# EAGLE design BluePill (EAGLE 8.3.1)
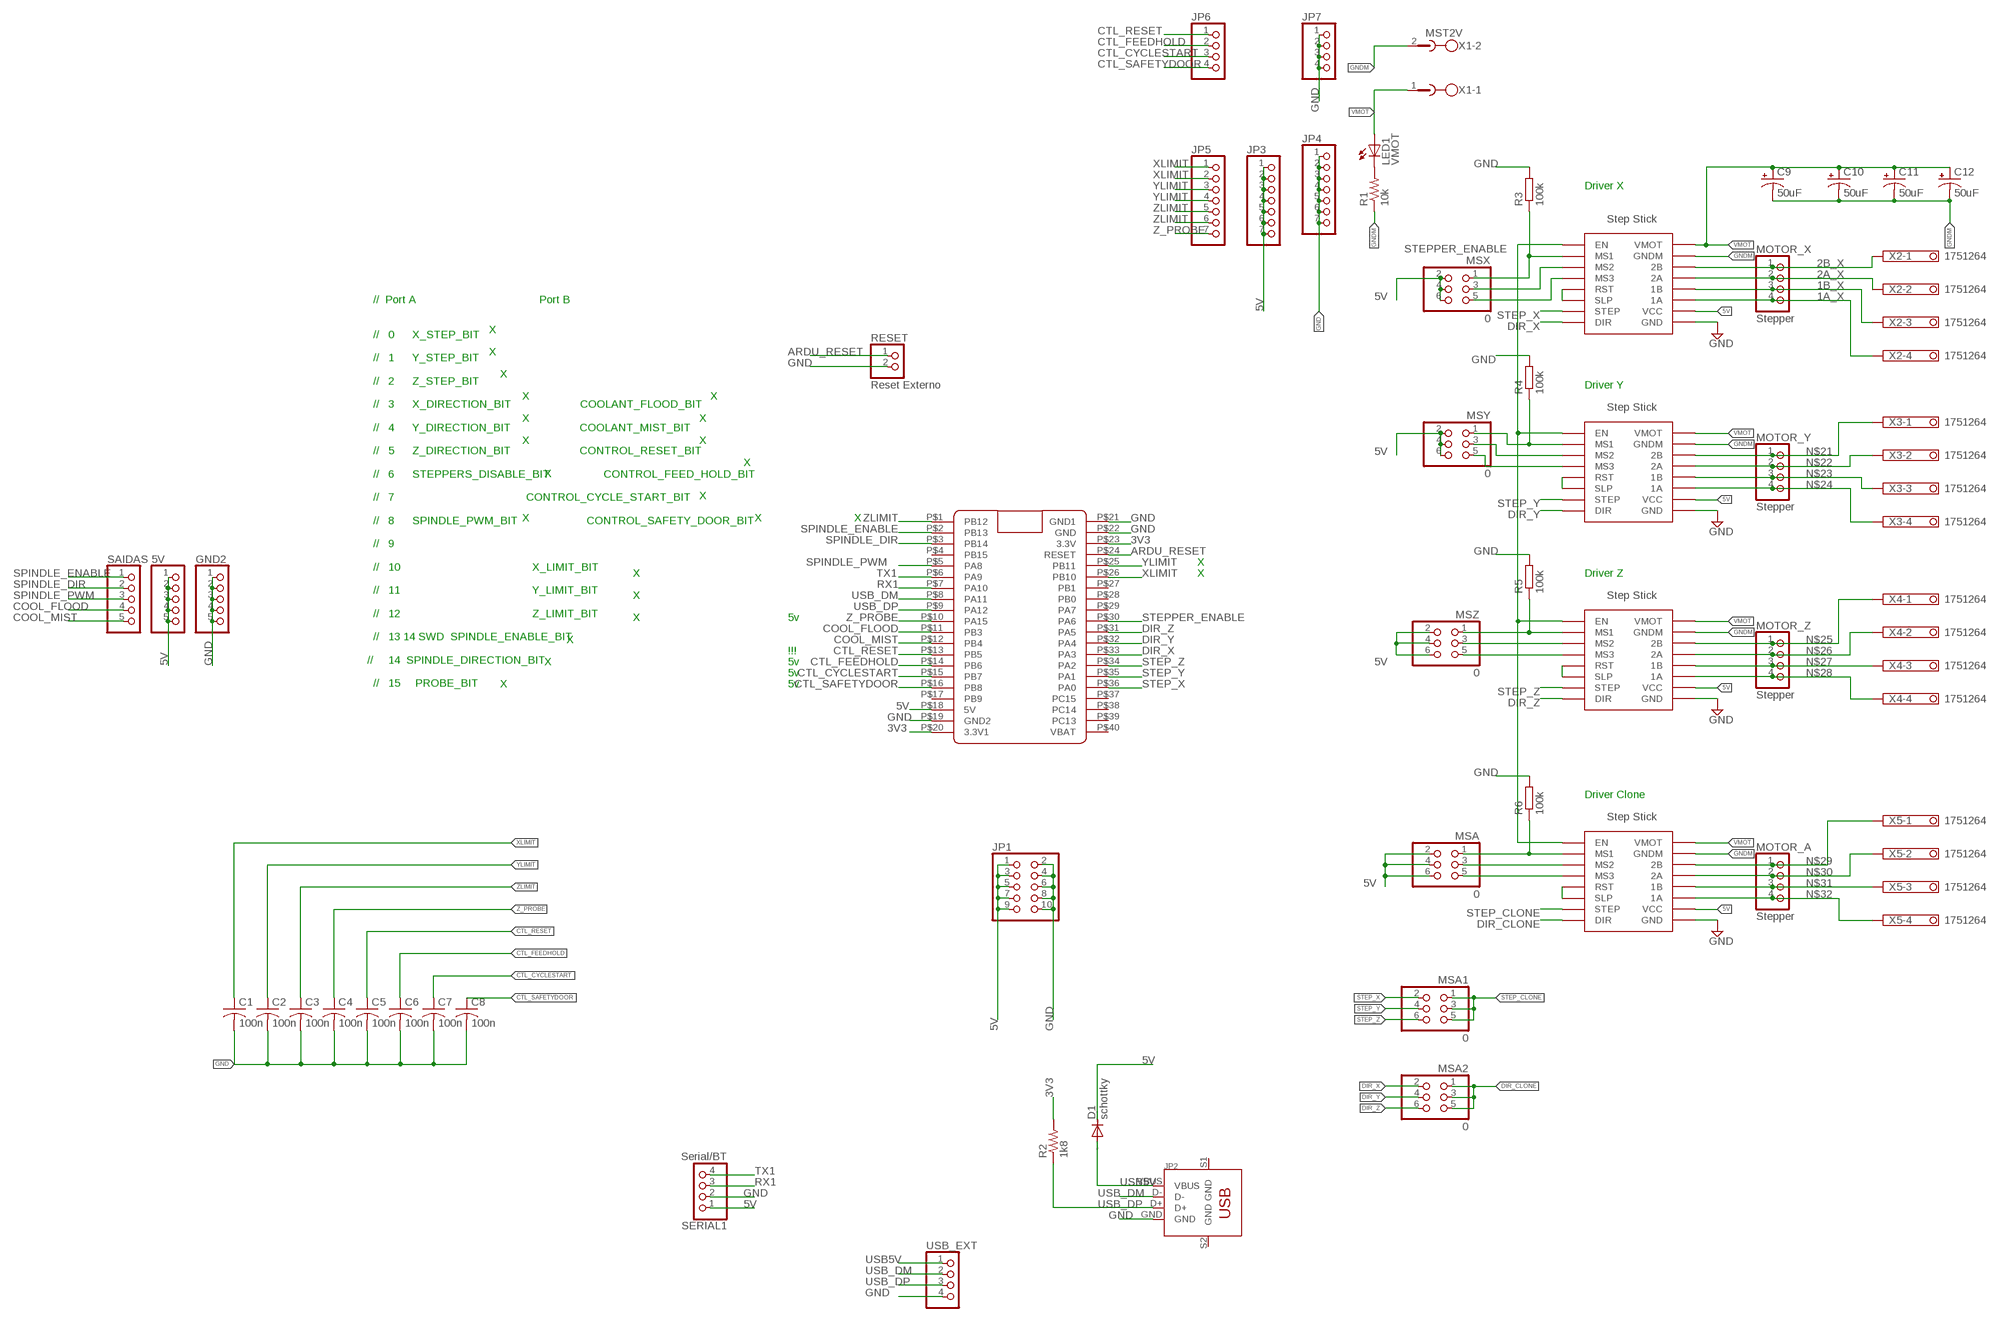
[diagram p0: schematic, sheet 1]

## Parts
5V  PINHD-1X5  [1X05]
C1  100n  C-USC0805K  [C0805K]
C2  100n  C-USC0805K  [C0805K]
C3  100n  C-USC0805K  [C0805K]
C4  100n  C-USC0805K  [C0805K]
C5  100n  C-USC0805K  [C0805K]
C6  100n  C-USC0805K  [C0805K]
C7  100n  C-USC0805K  [C0805K]
C8  100n  C-USC0805K  [C0805K]
C9  50uF  CPOL-USTT5D9L  [TT5D9L]
C10  50uF  CPOL-USTT5D9L  [TT5D9L]
C11  50uF  CPOL-USTT5D9L  [TT5D9L]
C12  50uF  CPOL-USTT5D9L  [TT5D9L]
D1  schottky  DIODE-DO-214AC  [DO-214AC]
DRIVER_CLONE  STEP-STICK  [STEP-STICK]
DRIVER_X  STEP-STICK  [STEP-STICK]
DRIVER_Y  STEP-STICK  [STEP-STICK]
DRIVER_Z  STEP-STICK  [STEP-STICK]
GND2  PINHD-1X5  [1X05]
JP1  PINHD-2X5  [2X05]
JP2  DIP-USB-B-TYPE-FMAL(4+2P-2.0-90D)  [USB4+2-2.5-90D-15.8X12MM]
JP3  PINHD-1X7  [1X07]
JP4  PINHD-1X7  [1X07]
JP5  PINHD-1X7  [1X07]
JP6  PINHD-1X4  [1X04]
JP7  PINHD-1X4  [1X04]
LED1  VMOT  LEDCHIP-LED0805  [CHIP-LED0805]
MOTOR_A  Stepper  PINHD-1X4  [1X04]
MOTOR_X  Stepper  PINHD-1X4  [1X04]
MOTOR_Y  Stepper  PINHD-1X4  [1X04]
MOTOR_Z  Stepper  PINHD-1X4  [1X04]
MSA  0  PINHD-2X3  [2X03]
MSA1  0  PINHD-2X3  [2X03]
MSA2  0  PINHD-2X3  [2X03]
MSX  0  PINHD-2X3  [2X03]
MSY  0  PINHD-2X3  [2X03]
MSZ  0  PINHD-2X3  [2X03]
R1  10k  R-US_M0805  [M0805]
R2  1k8  R-US_R0805  [R0805]
R3  100k  R-EU_R0805  [R0805]
R4  100k  R-EU_R0805  [R0805]
R5  100k  R-EU_R0805  [R0805]
R6  100k  R-EU_R0805  [R0805]
RESET  Reset Externo  PINHD-1X2  [1X02]
SAIDAS  PINHD-1X5  [1X05]
SERIAL1  Serial/BT  PINHD-1X4  [1X04]
U$1  BLUE_PILL  [BLUE_PILL]
USB_EXT  PINHD-1X4  [1X04]
X1  MST2V  [MSTBV2]
X2  1751264  [1751264]
X3  1751264  [1751264]
X4  1751264  [1751264]
X5  1751264  [1751264]

## Nets
1A_X: DRIVER_X.1A MOTOR_X.4 X2.4
1B_X: DRIVER_X.1B MOTOR_X.3 X2.3
2A_X: DRIVER_X.2A MOTOR_X.2 X2.2
2B_X: DRIVER_X.2B MOTOR_X.1 X2.1
3V3: R2.2 U$1.P$20(3.3V1) U$1.P$23(3.3V)
5V: 5V.1 5V.2 5V.3 5V.4 5V.5 D1.C DRIVER_CLONE.VCC DRIVER_X.VCC DRIVER_Y.VCC DRIVER_Z.VCC JP1.1 JP1.3 JP1.5 JP1.7 JP1.9 JP3.1 JP3.2 JP3.3 JP3.4 JP3.5 JP3.6 JP3.7 MSA.2 MSA.4 MSA.6 MSX.2 MSX.4 MSX.6 MSY.2 MSY.4 MSY.6 MSZ.2 MSZ.4 MSZ.6 SERIAL1.1 U$1.P$18(5V)
AMS1: DRIVER_CLONE.MS1 MSA.1 R6.1
AMS2: DRIVER_CLONE.MS2 MSA.3
AMS3: DRIVER_CLONE.MS3 MSA.5
ARDU_RESET: RESET.1 U$1.P$24(RESET)
COOL_FLOOD: SAIDAS.4 U$1.P$11(PB3)
COOL_MIST: SAIDAS.5 U$1.P$12(PB4)
CTL_CYCLESTART: C7.1 JP6.3 U$1.P$15(PB7)
CTL_FEEDHOLD: C6.1 JP6.2 U$1.P$14(PB6)
CTL_RESET: C5.1 JP6.1 U$1.P$13(PB5)
CTL_SAFETYDOOR: C8.1 JP6.4 U$1.P$16(PB8)
DIR_CLONE: DRIVER_CLONE.DIR MSA2.1 MSA2.3 MSA2.5
DIR_X: DRIVER_X.DIR MSA2.2 U$1.P$33(PA3)
DIR_Y: DRIVER_Y.DIR MSA2.4 U$1.P$32(PA4)
DIR_Z: DRIVER_Z.DIR MSA2.6 U$1.P$31(PA5)
GND: C1.2 C2.2 C3.2 C4.2 C5.2 C6.2 C7.2 C8.2 DRIVER_CLONE.GND DRIVER_X.GND DRIVER_Y.GND DRIVER_Z.GND GND2.1 GND2.2 GND2.3 GND2.4 GND2.5 JP1.2 JP1.4 JP1.6 JP1.8 JP1.10 JP2.GND JP4.1 JP4.2 JP4.3 JP4.4 JP4.5 JP4.6 JP4.7 JP7.1 JP7.2 JP7.3 JP7.4 R3.2 R4.2 R5.2 R6.2 RESET.2 SERIAL1.2 U$1.P$19(GND2) U$1.P$21(GND1) U$1.P$22(GND) USB_EXT.4
GNDM [potencia]: C9.- C10.- C11.- C12.- DRIVER_CLONE.GNDM DRIVER_X.GNDM DRIVER_Y.GNDM DRIVER_Z.GNDM R1.1 X1.2
MS1: DRIVER_X.MS1 MSX.1 R3.1
MS2: DRIVER_X.MS2 MSX.3
MS3: DRIVER_X.MS3 MSX.5
N$1: DRIVER_X.RST DRIVER_X.SLP
N$2: DRIVER_Y.RST DRIVER_Y.SLP
N$3: DRIVER_Z.RST DRIVER_Z.SLP
N$4: DRIVER_CLONE.RST DRIVER_CLONE.SLP
N$21: DRIVER_Y.2B MOTOR_Y.1 X3.1
N$22: DRIVER_Y.2A MOTOR_Y.2 X3.2
N$23: DRIVER_Y.1B MOTOR_Y.3 X3.3
N$24: DRIVER_Y.1A MOTOR_Y.4 X3.4
N$25: DRIVER_Z.2B MOTOR_Z.1 X4.1
N$26: DRIVER_Z.2A MOTOR_Z.2 X4.2
N$27: DRIVER_Z.1B MOTOR_Z.3 X4.3
N$28: DRIVER_Z.1A MOTOR_Z.4 X4.4
N$29: DRIVER_CLONE.2B MOTOR_A.1 X5.1
N$30: DRIVER_CLONE.2A MOTOR_A.2 X5.2
N$31: DRIVER_CLONE.1B MOTOR_A.3 X5.3
N$32: DRIVER_CLONE.1A MOTOR_A.4 X5.4
N$33: LED1.C R1.2
RX1: SERIAL1.3 U$1.P$7(PA10)
SPINDLE_DIR: SAIDAS.2 U$1.P$3(PB14)
SPINDLE_ENABLE: SAIDAS.1 U$1.P$2(PB13)
SPINDLE_PWM: SAIDAS.3 U$1.P$5(PA8)
STEP_CLONE: DRIVER_CLONE.SPT(STEP) MSA1.1 MSA1.3 MSA1.5
STEP_X: DRIVER_X.SPT(STEP) MSA1.2 U$1.P$36(PA0)
STEP_Y: DRIVER_Y.SPT(STEP) MSA1.4 U$1.P$35(PA1)
STEP_Z: DRIVER_Z.SPT(STEP) MSA1.6 U$1.P$34(PA2)
STEPPER_ENABLE: DRIVER_CLONE.EN DRIVER_X.EN DRIVER_Y.EN DRIVER_Z.EN U$1.P$30(PA6)
TX1: SERIAL1.4 U$1.P$6(PA9)
USB5V: D1.A JP2.VBUS USB_EXT.1
USB_DM: JP2.D- U$1.P$8(PA11) USB_EXT.2
USB_DP: JP2.D+ R2.1 U$1.P$9(PA12) USB_EXT.3
VMOT [potencia]: C9.+ C10.+ C11.+ C12.+ DRIVER_CLONE.VMOT DRIVER_X.VMOT DRIVER_Y.VMOT DRIVER_Z.VMOT LED1.A X1.1
XLIMIT: C1.1 JP5.1 JP5.2 U$1.P$26(PB10)
YLIMIT: C2.1 JP5.3 JP5.4 U$1.P$25(PB11)
YMS1: DRIVER_Y.MS1 MSY.1 R4.1
YMS2: DRIVER_Y.MS2 MSY.3
YMS3: DRIVER_Y.MS3 MSY.5
Z_PROBE: C4.1 JP5.7 U$1.P$10(PA15)
ZLIMIT: C3.1 JP5.5 JP5.6 U$1.P$1(PB12)
ZMS1: DRIVER_Z.MS1 MSZ.1 R5.1
ZMS2: DRIVER_Z.MS2 MSZ.3
ZMS3: DRIVER_Z.MS3 MSZ.5
Unconnected: JP2.S1(GND) JP2.S2(GND) U$1.P$4(PB15) U$1.P$17(PB9) U$1.P$27(PB1) U$1.P$28(PB0) U$1.P$29(PA7) U$1.P$37(PC15) U$1.P$38(PC14) U$1.P$39(PC13) U$1.P$40(VBAT)

## Notes on the sheet
- Driver X
- X
- X
- X
- Driver Y
- X | X
- X | X
- X | X
- X
- X
- X
- X | X | X
- X
- X | X | Driver Z
- X
- X | 5v
- X
- !!!
- X | 5v
- 5v
- X | 5v
- //  Port A                                         Port B
  
  
    //   0      X_STEP_BIT                             
  
    //   1      Y_STEP_BIT                            
  
    //   2      Z_STEP_BIT                               
  
    //   3      X_DIRECTION_BIT                       COOLANT_FLOOD_BIT
  
    //   4      Y_DIRECTION_BIT                       COOLANT_MIST_BIT
  
    //   5      Z_DIRECTION_BIT                       CONTROL_RESET_BIT
  
    //   6      STEPPERS_DISABLE_BIT                  CONTROL_FEED_HOLD_BIT    
  
    //   7                                            CONTROL_CYCLE_START_BIT
  
    //   8      SPINDLE_PWM_BIT                       CONTROL_SAFETY_DOOR_BIT    
  
    //   9                             
  
    //   10                                            X_LIMIT_BIT
  
    //   11                                            Y_LIMIT_BIT
  
    //   12                                            Z_LIMIT_BIT
  
    //   13 14 SWD  SPINDLE_ENABLE_BIT
  
  //     14  SPINDLE_DIRECTION_BIT
  
    //   15     PROBE_BIT
- Driver Clone

## Library data of the parts
5V GND2 SAIDAS = pinhead:PINHD-1X5: PIN HEADER
C1-C8 = adafruit:C-US: CAPACITOR, American symbol
C9-C12 = adafruit:CPOL-US: POLARIZED CAPACITOR, American symbol
D1 = diode:DIODE-: DIODE
DRIVER_CLONE DRIVER_X DRIVER_Y DRIVER_Z = Arduino-clone:STEP-STICK
JP1 = pinhead:PINHD-2X5: PIN HEADER
JP2 = Seeed-Connector:DIP-USB-B-TYPE-FMAL(4+2P-2.0-90D): 320010018
JP3-JP5 = pinhead:PINHD-1X7: PIN HEADER
JP6 JP7 MOTOR_A MOTOR_X MOTOR_Y MOTOR_Z SERIAL1 USB_EXT = pinhead:PINHD-1X4: PIN HEADER
LED1 = led:LED: LED OSRAM: - CHIPLED LG R971, LG N971, LY N971, LG Q971, LY Q971, LO R971, LY R971 LH N974, LH R974 LS Q976, LO Q976, LY Q976 LO Q996 - Hyper CHIPLED LW Q18S LB Q993, LB Q99A, LB R99A - SideLED LS A670, LO A670, LY A670, LG A670, LP A670 LB A673, LV A673, LT A673, LW A673 LH A674 LY A675 LS A676, LA A676, LO A676, LY A676, LW A676 LS A679, LY A679, LG A679 - Hyper Micro SIDELED® LS Y876, LA Y876, LO Y876, LY Y876 LT Y87S - SmartLED LW L88C, LW L88S LB L89C, LB L89S, LG L890 LS L89K, LO L89K, LY L89K LS L896, LA L896, LO L896, LY L896 - TOPLED LS T670, LO T670, LY T670, LG T670, LP T670 LSG T670, LSP T670, LSY T670, LOP T670, LYG T670 LG T671, LOG T671, LSG T671 LB T673, LV T673, LT T673, LW T673 LH T674 LS T676, LA T676, LO T676, LY T676, LB T676, LH T676, LSB T676, LW T676 LB T67C, LV T67C, LT T67C, LS T67K, LO T67K, LY T67K, LW E67C LS E67B, LA E67B, LO E67B, LY E67B, LB E67C, LV E67C, LT E67C LW T67C LS T679, LY T679, LG T679 LS T770, LO T770, LY T770, LG T770, LP T770 LB T773, LV T773, LT T773, LW T773 LH T774 LS E675, LA E675, LY E675, LS T675 LS T776, LA T776, LO T776, LY T776, LB T776 LHGB T686 LT T68C, LB T68C - Hyper Mini TOPLED® LB M676 - Mini TOPLED Santana® LG M470 LS M47K, LO M47K, LY M47K Source: http://www.osram.convergy.de LUXEON: - LUMILED® LXK2-PW12-R00, LXK2-PW12-S00, LXK2-PW14-U00, LXK2-PW14-V00 LXK2-PM12-R00, LXK2-PM12-S00, LXK2-PM14-U00 LXK2-PE12-Q00, LXK2-PE12-R00, LXK2-PE12-S00, LXK2-PE14-T00, LXK2-PE14-U00 LXK2-PB12-K00, LXK2-PB12-L00, LXK2-PB12-M00, LXK2-PB14-N00, LXK2-PB14-P00, LXK2-PB14-Q00 LXK2-PR12-L00, LXK2-PR12-M00, LXK2-PR14-Q00, LXK2-PR14-R00 LXK2-PD12-Q00, LXK2-PD12-R00, LXK2-PD12-S00 LXK2-PH12-R00, LXK2-PH12-S00 LXK2-PL12-P00, LXK2-PL12-Q00, LXK2-PL12-R00 Source: www.luxeon.com KINGBRIGHT: KA-3528ASYC Source: www.kingbright.com
MSA MSA1 MSA2 MSX MSY MSZ = pinhead:PINHD-2X3: PIN HEADER
R1 R2 = resistor:R-US_: RESISTOR, American symbol
R3-R6 = resistor:R-EU_: RESISTOR, European symbol
RESET = pinhead:PINHD-1X2: PIN HEADER
U$1 = BluePill:BLUE_PILL
X1 = con-phoenix-508:MST2V: PHOENIX; OC_FARNELL: unknown; OC_NEWARK: unknown
X2-X5 = con-phoenix-350:1751264: MKDS 1/ 4-3,5 Printklemme Nennstrom: 10 A Bemessungsspannung: 160 V Raster: 3,5 mm Polzahl: 4 Montageart: Löten Anschlussart: Schraubanschluss Anschlussrichtung vom Leiter zur Platine: 0° Source: http://eshop.phoenixcontact.com .. 1751264.pdf; MPN: 1751264; OC_FARNELL: unknown; OC_NEWARK: 10R0934

## Net classes
0 default: width 0.305 mm, clearance 0.254 mm
1 potencia: width 1.219 mm, clearance 0.61 mm

## Board
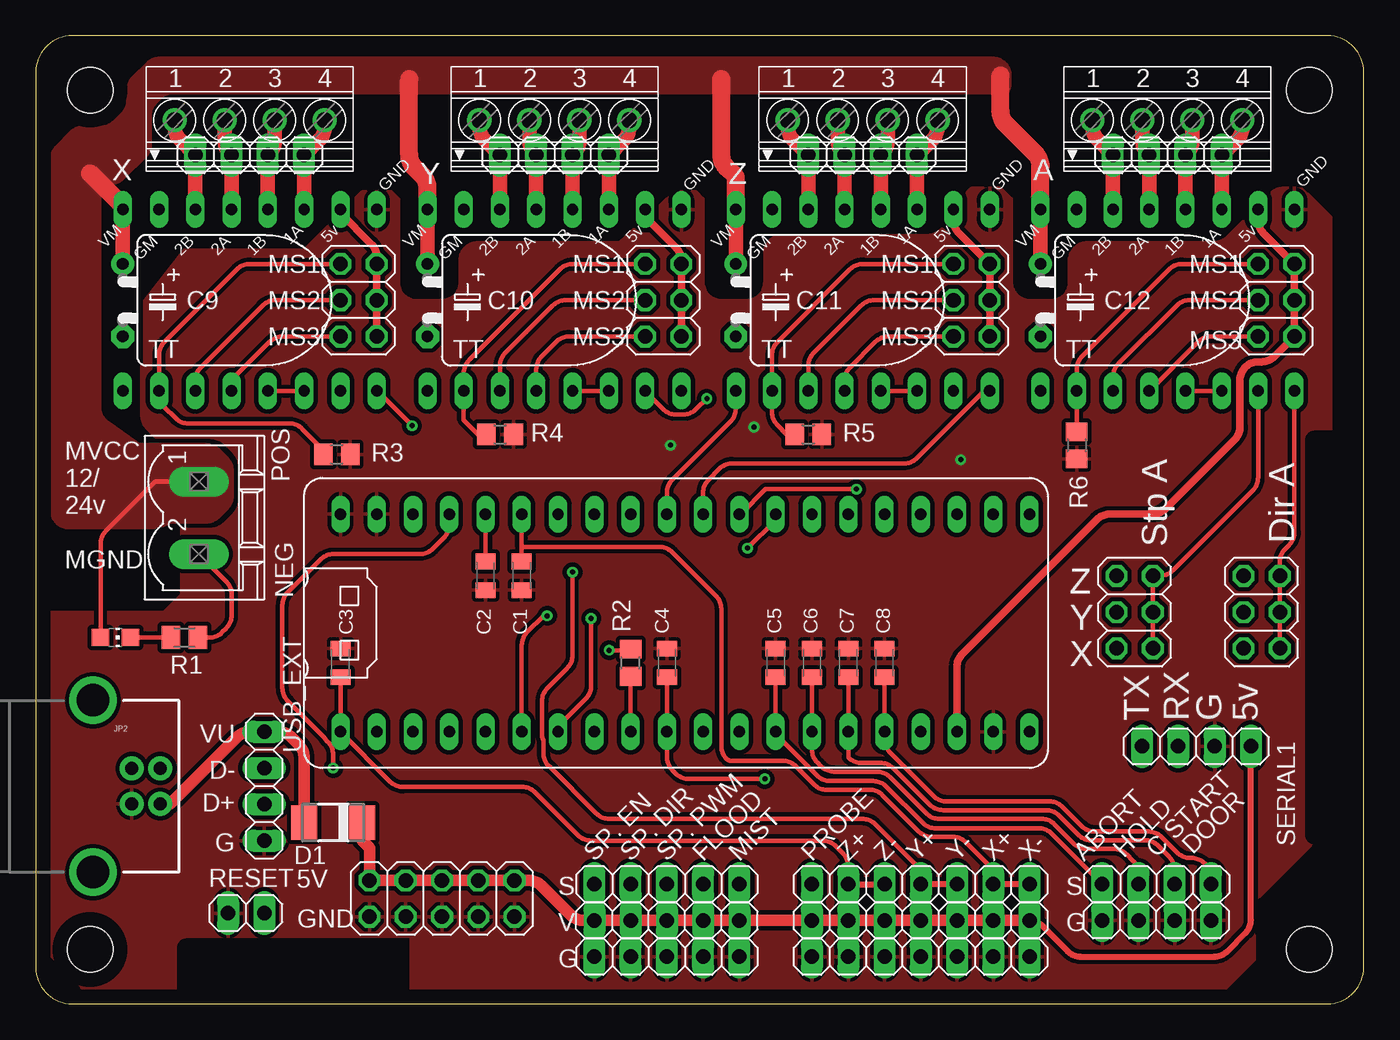
[diagram p1: board, top side]
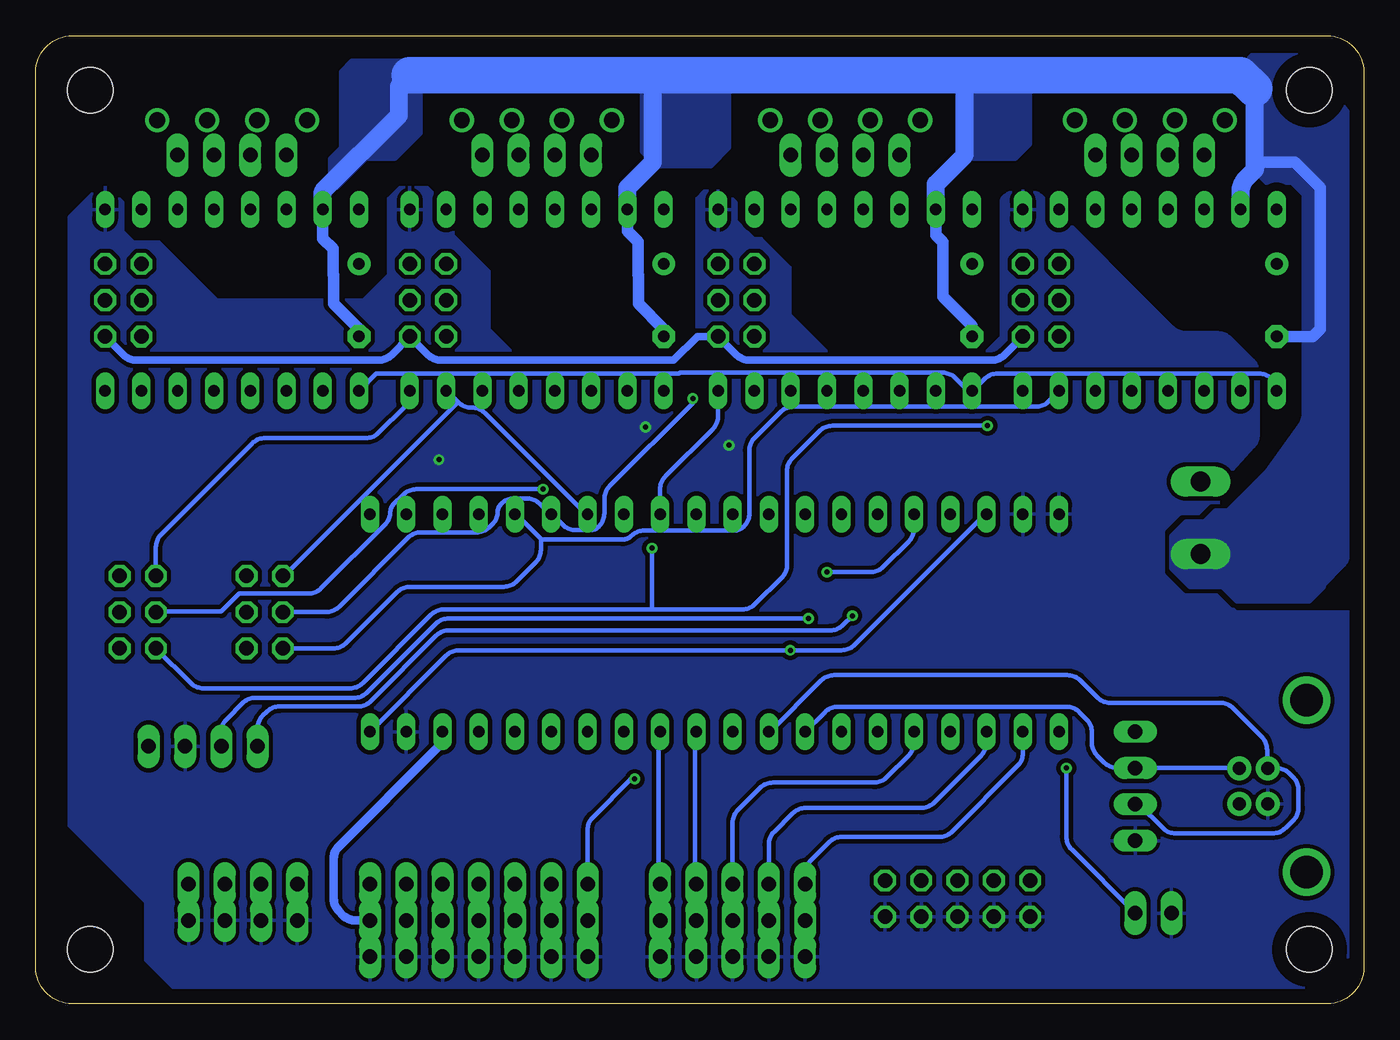
[diagram p2: board, bottom side, seen from below]

Size 93 x 67.8 mm. Coordinates in mm from the lower left corner, seen from the top.
Outline: 0,65.26 0,2.54 arc90 2.54,0 90.46,0 arc90 93,2.54 93,65.26 arc90 90.46,67.8 2.54,67.8 arc90 0,65.26
Copper layers (1*16): Top 0.035mm / dielectric 1.5mm / Bottom 0.035mm
Design rules "default *": minimum track width 8mil, minimum drill 0.35mm, track to track 12mil, track to pad 12mil, pad to pad 10mil, via to via 10mil, smd to smd 12mil, copper to edge 40mil, drill to drill 6mil, minimum pad ring 10mil, minimum via ring 8mil, stop-mask expansion 4mil, vias tented up to drill 20mil, thermal gap 10mil
Holes 3.17 mm at 3.81,3.81 3.81,63.99 89.19,63.99 89.19,3.81

### Footprints (pad centres in the part's own frame; a part is rotated, then mirrored left to right if it is on the bottom)
1X05 = drill 1.016 long: 1 -5.08,0; 2 -2.54,0; 3 0,0; 4 2.54,0; 5 5.08,0
C0805K = smd 1.1 x 1.4: 1 -1,0; 2 1,0
TT5D9L = drill 0.813 pad 1.6: + -2.54,0 | drill 0.813 pad 1.6 octagon: - 2.54,0
DO-214AC = smd 1.8 x 2.4: A 2.025,0; C -2.025,0
STEP-STICK = drill 0.8 long: 1A -8.89,-7.62; 1B -8.89,-5.08; 2A -8.89,-2.54; 2B -8.89,0; DIR 3.81,-12.7; EN 3.81,5.08; GND -8.89,-12.7; GNDM -8.89,2.54; MS1 3.81,2.54; MS2 3.81,0; MS3 3.81,-2.54; RST 3.81,-5.08; SLP 3.81,-7.62; SPT 3.81,-10.16; VCC -8.89,-10.16; VMOT -8.89,5.08
2X05 = drill 1.016 octagon: 1 -5.08,-1.27; 2 -5.08,1.27; 3 -2.54,-1.27; 4 -2.54,1.27; 5 0,-1.27; 6 0,1.27; 7 2.54,-1.27; 8 2.54,1.27; 9 5.08,-1.27; 10 5.08,1.27
USB4+2-2.5-90D-15.8X12MM = drill 0.914 pad 1.676: D+ 0,1.25; D- 1.981,1.25; GND 0,-1.25; VBUS 1.981,-1.25 | drill 2.286: S1 -2.718,-6.02; S2 -2.718,6.02
1X07 = drill 1.016 long: 1 -7.62,0; 2 -5.08,0; 3 -2.54,0; 4 0,0; 5 2.54,0; 6 5.08,0; 7 7.62,0
1X04 = drill 1.016 long: 1 -3.81,0; 2 -1.27,0; 3 1.27,0; 4 3.81,0
CHIP-LED0805 = smd 1.2 x 1.2: A 0,-1.05; C 0,1.05
2X03 = drill 1.016 octagon: 1 -2.54,-1.27; 2 -2.54,1.27; 3 0,-1.27; 4 0,1.27; 5 2.54,-1.27; 6 2.54,1.27
M0805 = smd 1.3 x 1.6: 1 -0.95,0; 2 0.95,0
R0805 = smd 1.3 x 1.5: 1 -0.95,0; 2 0.95,0
1X02 = drill 1.016 long: 1 -1.27,0; 2 1.27,0
BLUE_PILL = drill 0.8 long: P$1 -7.62,15.24; P$2 -7.62,12.7; P$3 -7.62,10.16; P$4 -7.62,7.62; P$5 -7.62,5.08; P$6 -7.62,2.54; P$7 -7.62,0; P$8 -7.62,-2.54; P$9 -7.62,-5.08; P$10 -7.62,-7.62; P$11 -7.62,-10.16; P$12 -7.62,-12.7; P$13 -7.62,-15.24; P$14 -7.62,-17.78; P$15 -7.62,-20.32; P$16 -7.62,-22.86; P$17 -7.62,-25.4; P$18 -7.62,-27.94; P$19 -7.62,-30.48; P$20 -7.62,-33.02; P$21 7.62,15.24; P$22 7.62,12.7; P$23 7.62,10.16; P$24 7.62,7.62; P$25 7.62,5.08; P$26 7.62,2.54; P$27 7.62,0; P$28 7.62,-2.54; P$29 7.62,-5.08; P$30 7.62,-7.62; P$31 7.62,-10.16; P$32 7.62,-12.7; P$33 7.62,-15.24; P$34 7.62,-17.78; P$35 7.62,-20.32; P$36 7.62,-22.86; P$37 7.62,-25.4; P$38 7.62,-27.94; P$39 7.62,-30.48; P$40 7.62,-33.02
MSTBV2 = drill 1.397 long: 1 -2.54,0; 2 2.54,0
1751264 = drill 1.1 pad 1.7: 1 -5.25,-0.1; 2 -1.75,-0.1; 3 1.75,-0.1; 4 5.25,-0.1

### Placement (x,y rotation side)
5V  44.2,5.84 180 top
C1  34.04,29.97 270 top
C2  31.5,29.97 270 top
C3  21.34,23.88 90 top
C4  44.2,23.88 90 top
C5  51.82,23.88 90 top
C6  54.36,23.88 90 top
C7  56.9,23.88 90 top
C8  59.44,23.88 90 top
C9  6.1,49.28 270 top
C10  27.43,49.28 270 top
C11  49.02,49.28 270 top
C12  70.36,49.28 270 top
D1  20.83,12.7 180 top
DRIVER_CLONE  75.44,46.74 270 bottom
DRIVER_X  11.18,46.74 270 bottom
DRIVER_Y  32.51,46.74 270 bottom
DRIVER_Z  54.1,46.74 270 bottom
GND2  44.2,3.3 0 top
JP1  28.45,7.37 180 top
JP2  6.73,15.24 0 top
JP3  61.98,5.84 180 top
JP4  61.98,3.3 180 top
JP5  61.98,8.38 180 top
JP6  78.49,8.38 0 top
JP7  78.49,5.84 180 top
LED1  5.59,25.65 270 top
MOTOR_A  79.25,59.44 0 top
MOTOR_X  14.99,59.44 0 top
MOTOR_Y  36.32,59.44 0 top
MOTOR_Z  57.91,59.44 0 top
MSA  86.87,49.28 270 top
MSA1  76.96,27.43 90 top
MSA2  85.85,27.43 90 top
MSX  22.61,49.28 270 top
MSY  43.94,49.28 270 top
MSZ  65.53,49.28 270 top
R1  10.41,25.65 180 top
R2  41.66,23.88 90 top
R3  21.08,38.48 0 top
R4  32.51,39.88 0 top
R5  54.1,39.88 0 top
R6  72.9,39.12 270 top
RESET  14.73,6.35 180 top
SAIDAS  44.2,8.38 0 top
SERIAL1  81.28,18.03 180 top
U$1  36.58,26.67 90 top
USB_EXT  16,15.24 270 top
X1  11.43,34.04 270 top
X2  14.99,61.98 0 top
X3  36.32,61.98 0 top
X4  57.91,61.98 0 top
X5  79.25,61.98 0 top

### Tracks (layer width: path | path; a pad name or v marks a point on that pad's centre or on a via)
1A_X
  Top 1.016: X2.4 20.24,61.4 arc-45 19.86,60.5 MOTOR_X.4 DRIVER_X.1A
1B_X
  Top 1.016: X2.3 16.74,60.44 arc-45 16.36,59.54 MOTOR_X.3 DRIVER_X.1B
2A_X
  Top 1.016: X2.2 13.24,60.44 arc45 13.61,59.54 MOTOR_X.2 DRIVER_X.2A
2B_X
  Top 1.016: X2.1 9.74,61.4 arc45 10.11,60.5 MOTOR_X.1 DRIVER_X.2B
3V3  (via drill 0.35)
  Top 0.305: v40.16,24.77 41.59,24.77 R2.2
  Bottom 0.305: U$1.P$23 26.51,34.29 35.66,25.14 arc45 36.56,24.77 v40.16,24.77 63.35,24.77 arc-45 64.25,24.39 U$1.P$20
5V
  Top 0.406: JP3.1 arc-45 70.46,5.48 72.27,3.67 arc45 73.17,3.3 82.53,3.3 arc45 83.43,3.67 84.72,4.96 arc45 85.09,5.86 SERIAL1.1
  Top 0.508: DRIVER_X.VCC 21.34,55.37 23.5,53.2 arc-45 23.88,52.31 MSX.2 MSX.4 MSX.6 | DRIVER_Y.VCC 42.67,55.12 44.84,52.95 arc-45 45.21,52.05 MSY.2 MSY.4 MSY.6 | DRIVER_Z.VCC 64.26,54.88 arc45 64.63,53.98 MSZ.2 MSZ.4 MSZ.6 | DRIVER_CLONE.VCC 85.6,54.88 arc45 85.97,53.98 MSA.2 MSA.4 MSA.6 86.73,45.33 arc-45 85.83,44.96 85.6,44.96 arc90 84.33,43.69 84.33,40.4 arc-45 83.96,39.51 79.11,34.66 arc-45 78.21,34.29 75.2,34.29 arc45 74.3,33.92 64.89,24.5 arc45 64.52,23.6 U$1.P$18
  Top 0.813: D1.C 22.85,11.44 23.37,10.92 JP1.9 JP1.7 JP1.5 JP1.3 JP1.1 34.53,8.64 arc-45 35.42,8.26 37.47,6.21 arc45 38.37,5.84 5V.5 5V.4 5V.3 5V.2 5V.1 JP3.7 JP3.6 JP3.5 JP3.4 JP3.3 JP3.2 JP3.1
  Bottom 0.305: 64.61,19.05 U$1.P$18
  Bottom 0.508: MSA.6 86.85,45.44 arc-45 85.95,45.07 68.99,45.07 arc-45 68.09,45.44 MSZ.6 65.51,45.44 arc-45 64.61,45.07 48.33,45.07 46.67,46.74 MSY.6 43.92,45.44 arc-45 43.02,45.07 26.07,45.07 arc-45 25.17,45.44 MSX.6
  Bottom 0.61: JP3.1 70.59,5.84 arc45 71.49,6.21 71.76,6.49 arc45 72.14,7.38 72.14,10.14 arc45 71.76,11.04 64.98,17.82 arc-45 64.61,18.72 64.61,19.05
AMS1
  Top 0.305: R6.1 DRIVER_CLONE.MS1 72.9,44.43 arc-45 73.27,45.33 79.38,51.44 arc-45 80.28,51.82 MSA.1
AMS2
  Top 0.305: DRIVER_CLONE.MS2 75.44,43.92 arc-45 75.81,44.82 79.89,48.9 arc-45 80.79,49.28 MSA.3
AMS3
  Top 0.305: DRIVER_CLONE.MS3 81.42,46.36 arc-45 82.31,46.74 MSA.5
ARDU_RESET  (via drill 0.35)
  Top 0.305: v20.83,16.51 20.83,17.46 arc45 20.46,18.36 20.23,18.59 20.23,18.64 17.64,21.22 arc-45 17.27,22.12 17.27,27.92 arc-45 17.64,28.82 19.95,31.12 arc-45 20.85,31.5 26.91,31.5 arc45 27.8,31.87 28.58,32.65 arc45 28.96,33.55 U$1.P$24
  Bottom 0.305: 20.83,16.26 v20.83,16.51 20.83,11.7 arc-45 20.46,10.8 RESET.1
COOL_FLOOD
  Bottom 0.305: U$1.P$11 46.83,19.05 46.83,8.41 SAIDAS.4
COOL_MIST
  Bottom 0.305: U$1.P$12 49.37,19.05 49.37,8.41 SAIDAS.5
CTL_CYCLESTART
  Top 0.305: C7.1 U$1.P$15 56.9,17.32 arc45 56.93,17.24 arc45 57.83,16.87 59.16,16.87 arc-45 60.06,16.49 62.62,13.94 arc45 63.52,13.56 70.75,13.56 arc-45 71.64,13.19 73.01,11.83 arc45 73.91,11.46 77.68,11.46 arc-45 78.58,11.08 79.38,10.28 arc-45 79.76,9.38 JP6.3
CTL_FEEDHOLD
  Top 0.305: C6.1 U$1.P$14 54.36,17.8 arc45 54.73,16.9 55,16.63 arc45 55.9,16.26 58.91,16.26 arc-45 59.81,15.88 62.37,13.33 arc45 63.26,12.95 70.44,12.95 arc-45 71.34,12.58 72.7,11.22 arc45 73.6,10.85 75.5,10.85 arc-45 76.39,10.47 76.84,10.02 arc-45 77.22,9.13 JP6.2
CTL_RESET
  Top 0.305: C5.1 U$1.P$13 51.82,18.9 54.75,15.97 arc45 55.64,15.6 58.65,15.6 arc-45 59.55,15.22 62.11,12.67 arc45 63.01,12.29 70.24,12.29 arc-45 71.14,11.92 JP6.1
  Bottom 0.305: 51.91,19.05 U$1.P$13
CTL_SAFETYDOOR
  Top 0.305: C8.1 U$1.P$16 59.44,18.51 arc45 59.81,17.61 62.87,14.54 arc45 63.77,14.17 71,14.17 arc-45 71.9,13.8 73.26,12.44 arc45 74.16,12.06 77.93,12.06 arc-45 78.83,11.69 79.94,10.58 arc45 80.84,10.21 80.96,10.21 arc-45 81.86,9.84 81.92,9.77 arc-45 82.3,8.87 JP6.4
  Bottom 0.305: 59.37,19.05 U$1.P$16
DIR_CLONE
  Top 0.305: MSA2.1 MSA2.3 MSA2.5 87.12,30.97 arc-45 87.49,31.87 87.77,32.14 arc45 88.14,33.04 DRIVER_CLONE.DIR
DIR_X  (via drill 0.35)
  Top 0.305: v26.35,40.48 23.97,42.86 DRIVER_X.DIR | v49.85,31.91 51.75,33.81 51.75,34.29 U$1.P$33
  Bottom 0.305: 49.85,27.62 64.4,27.62 arc-45 65.3,27.25 70.08,22.47 arc45 70.98,22.1 81.26,22.1 arc45 82.16,22.47 MSA2.2 | 49.85,27.62 v49.85,31.91 | v26.35,40.48 37.23,40.48 arc-45 38.12,40.11 40.01,38.22 arc-45 40.39,37.32 40.39,30.75 arc45 40.76,29.85 42.62,27.99 arc45 43.52,27.62 49.85,27.62
DIR_Y  (via drill 0.35)
  Top 0.305: v57.47,36.04 51.12,36.04 49.37,34.29 U$1.P$32
  Bottom 0.305: 49.21,34.29 U$1.P$32 49.28,36.05 arc45 48.9,36.95 45.58,40.27 arc-45 45.21,41.17 DRIVER_Y.DIR 45.24,42.86 | MSA2.4 84.45,27.46 80.01,27.46 78.74,28.73 73.9,28.73 arc-45 73,29.11 68.54,33.57 arc-45 68.17,34.47 arc45 67.97,34.95 67.25,35.66 arc45 66.36,36.04 v57.47,36.04
DIR_Z
  Top 0.305: DRIVER_Z.DIR 66.67,42.86 66.36,42.86 61.71,38.22 arc-45 60.81,37.85 48.79,37.85 arc45 47.89,37.47 47.11,36.69 arc45 46.74,35.8 U$1.P$31
  Bottom 0.305: 84.5,29.99 84.45,30 | 84.5,29.99 MSA2.6 | 66.83,42.86 DRIVER_Z.DIR 66.8,42.69 arc45 67.17,41.79 68.97,40 arc45 69.87,39.62 76.94,39.62 arc-45 77.84,39.25 84.21,32.88 arc-45 84.58,31.99 84.58,30.07 84.5,29.99
GND  (via drill 0.35)
  other vias: 44.45,39.12 50.29,40.39 64.77,38.1
  pour Top (rank 2): -1.27,27.43 8.89,27.43 10.16,28.7 10.16,37.85 7.74,40.27 arc-45 7.37,41.17 7.37,44.7 9.65,46.99 12.95,46.99 22.86,56.9 24.89,56.9 25.4,56.39 25.4,46.74 27.18,44.96 36.83,44.96 40.13,48.26 40.13,51.56 42.16,53.59 42.67,53.59 43.94,54.86 43.94,56.13 44.7,56.9 46.23,56.9 46.74,56.39 46.74,46.74 48.77,44.7 58.67,44.7 61.21,47.24 61.21,51.31 63.75,53.85 63.75,55.37 65.53,57.15 67.56,57.15 68.33,56.39 68.33,40.4 arc135 70.49,39.51 84.33,53.34 86.11,53.34 86.87,54.1 86.87,56.13 87.88,57.15 88.65,57.15 90.68,55.12 90.68,12.45 85.34,7.11 85.34,3.05 83.31,1.02 3.3,1.02 0.76,3.56 0.76,18.29 -1.27,20.32
  pour Top: -1.27,27.43 8.89,27.43 16.76,30.48 16.76,40.89 7.37,40.89 7.37,44.7 9.65,46.99 12.95,46.99 22.86,56.9 24.89,56.9 25.4,56.39 25.4,46.74 27.18,44.96 36.83,44.96 40.13,48.26 40.13,51.56 42.16,53.59 42.67,53.59 43.94,54.86 43.94,56.13 44.7,56.9 46.23,56.9 46.74,56.39 46.74,46.74 48.77,44.7 58.67,44.7 61.21,47.24 61.21,51.31 63.75,53.85 63.75,55.37 65.53,57.15 67.56,57.15 68.33,56.39 68.33,49.28 80.26,49.28 84.33,53.34 86.11,53.34 86.87,54.1 86.87,56.13 87.88,57.15 88.65,57.15 90.68,55.12 90.68,12.45 85.34,7.11 85.34,3.05 83.31,1.02 3.3,1.02 0.76,3.56 0.76,18.29 -1.27,20.32
  pour Top (rank 2): -1.27,27.43 8.89,27.43 14.48,29.21 14.48,38.53 arc82 13.39,39.78 8.7,40.48 arc-82 7.62,41.74 7.62,49.28 10.41,52.83 18.8,52.83 22.86,56.9 24.89,56.9 25.4,56.39 25.4,50.55 arc90 26.67,49.28 28.45,49.28 arc90 29.72,50.55 29.72,52.07 arc-90 30.99,53.34 40.89,53.34 43.94,56.13 44.7,56.9 46.23,56.9 46.74,56.39 46.74,50.55 arc90 48.01,49.28 49.78,49.28 arc90 51.05,50.55 51.05,52.58 arc-90 52.32,53.85 62.48,53.85 arc90 63.75,55.12 63.75,55.37 65.53,57.15 67.56,57.15 68.33,56.39 68.33,50.55 arc90 69.6,49.28 71.12,49.28 arc90 72.39,50.55 72.39,52.07 arc-90 73.66,53.34 82.53,53.34 arc45 83.43,53.71 86.5,56.78 arc-45 87.39,57.15 88.65,57.15 90.68,55.12 90.68,12.45 85.34,7.11 85.34,3.05 83.31,1.02 3.3,1.02 0.76,3.56 0.76,18.29 -1.27,20.32
  pour Bottom (rank 2): -1.27,27.43 8.89,27.43 10.16,28.7 10.16,35.8 arc45 9.79,36.69 7.69,39.03 arc-42 7.37,39.88 7.37,44.18 arc-45 7.74,45.08 9.28,46.62 arc-45 10.18,46.99 12.43,46.99 arc45 13.33,47.36 22.49,56.52 arc-45 23.39,56.9 24.37,56.9 arc-45 25.26,56.52 arc-45 25.4,56.2 25.4,46.74 26.81,45.33 arc45 27.7,44.96 36.83,44.96 40.13,48.26 40.13,51.56 42.16,53.59 42.67,53.59 43.94,54.86 43.94,56.13 44.7,56.9 46.23,56.9 46.74,56.39 46.74,46.74 48.77,44.7 58.67,44.7 61.21,47.24 61.21,51.31 63.75,53.85 63.75,55.37 65.53,57.15 67.56,57.15 68.33,56.39 68.33,51.05 70.1,49.28 80.26,49.28 84.33,53.34 86.11,53.34 86.87,54.1 86.87,56.13 87.88,57.15 88.65,57.15 90.68,55.12 90.68,12.45 85.34,7.11 85.34,3.05 83.31,1.02 3.3,1.02 0.76,3.56 0.76,18.29 -1.27,20.32
GNDM
  Top 0.305: R1.1 12.17,25.65 arc45 13.07,26.03 13.34,26.3 arc45 13.72,27.2 13.72,28.68 arc45 13.34,29.58 X1.2
  Bottom 0.813: 7.62,58.42 7.11,58.93 4.83,58.93 3.05,57.15 3.05,47.24 3.56,46.74 C9.- | C10.- 27.43,47.5 29.46,49.53 29.46,53.34 29.97,53.85 DRIVER_Y.GNDM | C11.- 49.02,47.24 50.8,49.02 50.8,51.03 50.84,51.06 50.84,53.38 51.56,54.1 DRIVER_Z.GNDM | C12.- 70.36,47.24 72.14,49.02 72.14,51.03 72.17,51.06 72.17,52.87 72.9,53.59 DRIVER_CLONE.GNDM
  Bottom 1.27: DRIVER_Y.GNDM 29.97,57.4 27.94,59.44 27.94,64.53 27.44,65.02 | DRIVER_Z.GNDM 51.56,57.15 49.78,58.93 49.78,65.01 49.77,65.02 | DRIVER_CLONE.GNDM 72.9,56.9 67.56,62.23 67.56,64.26 66.8,65.02 | DRIVER_X.GNDM 8.64,56.88 arc45 8.26,57.78 7.62,58.42 7.62,64.01 7.68,64.07
  Bottom 2.54: 66.8,65.02 49.77,65.02 27.44,65.02 8.64,65.02 7.68,64.07
  pour Bottom: 2.79,29.21 7.87,29.21 9.4,30.73 9.65,34.54 6.86,37.34 4.55,40.56 arc-36 4.32,41.3 4.32,56.64 5.08,57.4 6.86,57.4 8.13,58.67 8.13,63.5 6.86,64.77 8.13,66.04 8.13,66.29 7.87,66.55 4.06,66.55 1.02,62.48 1.02,31.51 arc45 1.39,30.62
  pour Bottom (no thermals): 8.89,34.54 10.41,34.54 11.18,33.78 12.45,33.78 13.46,32.77 13.46,30.48 12.19,29.21 9.91,29.21 8.89,28.19 3.81,28.19 2.79,29.21 2.79,33.78
  pour Bottom: 67.06,66.04 70.87,66.04 71.63,65.28 71.63,59.94 72.39,59.18 72.39,57.4 72.14,57.15 71.88,57.15 69.85,59.18 67.82,59.18 66.04,60.96 66.04,65.02
  pour Bottom: 49.02,58.67 45.72,58.67 44.45,59.94 44.45,64.52 44.2,64.77 50.04,64.77 50.55,64.26 50.55,59.69 49.53,58.67
  pour Bottom: 23.37,64.01 23.37,60.2 24.38,59.18 27.94,59.18 28.45,59.69 28.45,63.75 23.62,63.75
MS1
  Top 0.305: R3.1 20.13,38.8 18.66,40.27 arc45 17.76,40.64 10.69,40.64 arc-45 9.79,41.01 9.01,41.79 arc-45 8.64,42.69 DRIVER_X.MS1 8.64,45.45 arc-45 9.01,46.35 14.11,51.44 arc-45 15,51.82 MSX.1
MS2
  Top 0.305: DRIVER_X.MS2 11.18,43.67 arc-45 11.55,44.57 15.88,48.9 arc-45 16.78,49.28 MSX.3
MS3
  Top 0.305: DRIVER_X.MS3 13.72,43.16 arc-45 14.09,44.06 16.39,46.36 arc-45 17.29,46.74 MSX.5
N$1
  Top 0.305: DRIVER_X.RST DRIVER_X.SLP
N$2
  Top 0.305: DRIVER_Y.RST DRIVER_Y.SLP
N$3
  Top 0.305: DRIVER_Z.RST DRIVER_Z.SLP
N$4
  Top 0.305: DRIVER_CLONE.RST DRIVER_CLONE.SLP
N$7
  cutout Top: 9.91,1.02 9.91,3.94 arc-90 10.54,4.57 26.16,4.57 26.16,1.02
N$8
  cutout Top: 91.95,11.18 89.53,11.18 arc-90 88.9,11.81 88.9,39.5 arc-90 89.53,40.13 91.95,40.13
N$21
  Top 1.016: X3.1 31.07,61.4 arc45 31.44,60.5 MOTOR_Y.1 DRIVER_Y.2B
N$22
  Top 1.016: X3.2 34.57,60.44 arc45 34.94,59.54 MOTOR_Y.2 DRIVER_Y.2A
N$23
  Top 1.016: X3.3 38.07,60.44 arc-45 37.7,59.54 MOTOR_Y.3 DRIVER_Y.1B
N$24
  Top 1.016: X3.4 41.57,61.4 arc-45 41.2,60.5 MOTOR_Y.4 DRIVER_Y.1A
N$25
  Top 1.016: X4.1 52.66,61.4 arc45 53.03,60.5 MOTOR_Z.1 DRIVER_Z.2B
N$26
  Top 1.016: X4.2 56.16,60.44 arc45 56.53,59.54 MOTOR_Z.2 DRIVER_Z.2A
N$27
  Top 1.016: X4.3 59.66,60.44 arc-45 59.29,59.54 MOTOR_Z.3 DRIVER_Z.1B
N$28
  Top 1.016: X4.4 63.16,61.4 arc-45 62.79,60.5 MOTOR_Z.4 DRIVER_Z.1A
N$29
  Top 1.016: X5.1 74,61.4 arc45 74.37,60.5 MOTOR_A.1 DRIVER_CLONE.2B
N$30
  Top 1.016: X5.2 77.5,60.44 arc45 77.87,59.54 MOTOR_A.2 DRIVER_CLONE.2A
N$31
  Top 1.016: X5.3 81,60.44 arc-45 80.63,59.54 MOTOR_A.3 DRIVER_CLONE.1B
N$32
  Top 1.016: X5.4 84.5,61.4 arc-45 84.13,60.5 MOTOR_A.4 DRIVER_CLONE.1A
N$33
  Top 0.305: LED1.C R1.2
RX1  (via drill 0.35)
  Top 0.305: v38.89,26.99 38.89,22.27 arc-45 38.52,21.38 37.01,19.86 arc45 36.67,19.05 U$1.P$7
  Bottom 0.305: v38.89,26.99 64.08,26.99 arc-45 64.98,26.62 69.8,21.8 arc45 70.69,21.43 77.61,21.43 arc-45 78.51,21.06 79.64,19.93 arc-45 80.01,19.03 SERIAL1.3
SPINDLE_DIR
  Bottom 0.305: U$1.P$3 26.42,18.31 arc45 26.79,17.41 30.11,14.09 arc45 31.01,13.72 39.1,13.72 arc-45 40,13.34 41.28,12.06 arc-45 41.66,11.16 SAIDAS.2
SPINDLE_ENABLE
  Bottom 0.305: U$1.P$2 23.88,17.54 arc45 24.25,16.65 28.84,12.06 arc45 29.74,11.68 36.56,11.68 arc-45 37.46,11.31 38.74,10.02 arc-45 39.12,9.13 SAIDAS.1
SPINDLE_PWM
  Bottom 0.305: SAIDAS.3 44.13,8.41 44.2,8.48 44.2,12.68 arc45 43.82,13.58 42.28,15.12 arc45 41.38,15.49 34.31,15.49 arc-45 33.41,15.87 31.87,17.41 arc-45 31.5,18.31 U$1.P$5
STEP_CLONE
  Top 0.305: MSA1.1 MSA1.3 MSA1.5 78.72,29.97 arc45 79.62,30.34 85.23,35.95 arc45 85.6,36.85 DRIVER_CLONE.SPT
STEP_X
  Bottom 0.305: 57.63,32.54 59.37,34.29 U$1.P$36 | 59.37,34.13 U$1.P$36 | U$1.P$36 59.46,34.29 | 57.63,32.54 57.63,31.8 arc45 58,30.9 59.32,29.58 arc45 60.22,29.21 66.78,29.21 arc-45 67.68,28.84 71.26,25.26 arc45 72.15,24.89 MSA1.2 | 57.63,32.54 57.59,32.51 51.93,32.51 arc-45 51.3,32.77 arc45 50.41,33.14 44.12,33.14 arc-45 43.39,33.44 arc-45 43.02,34.34 43.02,38.75 arc45 42.65,39.65 40.85,41.44 arc45 39.95,41.81 22.97,41.81 arc-45 22.07,42.19 DRIVER_X.SPT
STEP_Y  (via drill 0.35)
  Top 0.305: v46.99,42.39 46.25,41.65 arc-45 45.35,41.27 44.82,41.27 arc-45 43.92,41.65 42.7,42.86 DRIVER_Y.SPT
  Bottom 0.305: v46.99,42.39 46.99,42.07 52.81,36.25 arc-45 53.18,35.35 53.18,34.34 arc45 53.55,33.44 arc45 54.19,33.18 55.2,33.18 arc45 56.09,33.55 56.83,34.29 U$1.P$35 56.99,34.29 57.73,35.03 arc-45 58.63,35.4 59.48,35.4 arc-45 60.38,35.03 60.45,34.96 arc-45 60.64,34.5 arc45 61.01,33.6 61.22,33.39 arc45 62.12,33.02 66.02,33.02 arc-45 66.92,32.65 71.76,27.8 arc45 72.66,27.43 MSA1.4 | MSA1.4 75.56,27.46 | MSA1.4 75.18,27.43
STEP_Z
  Bottom 0.305: 63.42,42.15 63.4,42.12 arc-45 62.5,41.75 62.44,41.75 arc45 61.54,41.38 54.45,34.29 U$1.P$34 | 63.42,42.15 64.14,42.86 DRIVER_Z.SPT | 63.42,42.15 75.56,30 MSA1.6
STEPPER_ENABLE
  Top 0.305: U$1.P$30 44.2,35.8 arc-45 44.57,36.69 48.65,40.78 arc45 49.02,41.67 DRIVER_Z.EN
  Bottom 0.305: DRIVER_X.EN 6.1,42.97 arc-45 6.42,43.76 arc-45 7.32,44.13 25.67,44.13 arc-45 26.57,43.76 27.3,43.02 DRIVER_Y.EN | 48.97,44.13 47.94,44.13 47.88,44.2 29.48,44.2 arc45 28.58,43.82 27.69,42.93 DRIVER_Y.EN | 27.46,42.86 DRIVER_Y.EN | DRIVER_Z.EN 49.02,44.08 48.97,44.13 | DRIVER_CLONE.EN 69.15,44.13 48.97,44.13
TX1  (via drill 0.35)
  Top 0.305: 33.99,19.05 33.97,19.05 | 33.99,19.05 U$1.P$6 | v35.81,27.18 35.56,27.18 34.41,26.03 arc45 34.04,25.13 34.04,19.09 33.99,19.05
  Bottom 0.305: SERIAL1.4 77.47,19.29 arc45 77.1,20.18 76.83,20.45 arc45 75.93,20.82 70.44,20.82 arc-45 69.54,21.19 64.96,25.78 arc45 64.06,26.15 37.37,26.15 arc-45 36.47,26.52 v35.81,27.18
USB5V
  Top 0.813: D1.A 18.8,17.25 arc45 18.42,18.15 17.9,18.68 arc45 17,19.05 USB_EXT.1 15,19.05 arc45 14.11,18.68 9.42,13.99 JP2.VBUS
USB_DM
  Bottom 0.305: 15.98,16.49 USB_EXT.2 | USB_EXT.2 17.25,16.51 arc45 18.15,16.88 18.68,17.41 arc45 19.05,18.31 19.05,19.03 arc-45 19.42,19.93 19.92,20.42 arc-45 20.81,20.8 36.84,20.8 arc-45 37.74,20.42 U$1.P$8 | USB_EXT.2 8.73,16.51 JP2.D-
USB_DP
  Top 0.305: R2.1 U$1.P$9
  Bottom 0.305: U$1.P$9 41.59,19.05 38,22.65 arc45 37.1,23.02 20.75,23.02 arc45 19.85,22.65 18.66,21.45 arc-45 17.76,21.08 10.06,21.08 arc45 9.17,20.71 7.15,18.69 arc45 6.77,17.79 6.77,16.53 JP2.D+ 6.13,16.49 6.11,16.51 arc45 5.22,16.14 4.94,15.87 arc45 4.57,14.97 4.57,13.73 arc45 4.94,12.84 5.47,12.31 arc45 6.37,11.94 13.19,11.94 arc45 14.09,12.31 15.75,13.97 USB_EXT.3
VMOT
  Top 0.305: LED1.A 4.54,32.21 arc-45 4.91,33.1 8.38,36.58 X1.1
  Top 1.016: C9.+ DRIVER_X.VMOT | C10.+ DRIVER_Y.VMOT | C11.+ DRIVER_Z.VMOT | C12.+ DRIVER_CLONE.VMOT
  Top 1.27: DRIVER_CLONE.VMOT 70.36,58.66 arc45 69.99,59.55 67.94,61.6 arc-45 67.56,62.5 67.56,65.02 | DRIVER_Z.VMOT 49.02,57.91 48.38,58.56 arc-45 48.01,59.45 48.01,64.77 | DRIVER_Y.VMOT 27.43,57.13 arc45 27.06,58.03 26.53,58.56 arc-45 26.16,59.45 26.16,64.77 | DRIVER_X.VMOT 6.1,55.88 3.81,58.17
  pour Top: 1.39,33.66 1.41,33.65 arc45 2.3,33.27 8.38,33.27 9.4,34.29 9.91,37.34 5.1,40.77 arc-54 4.57,41.8 4.57,56.9 5.08,57.4 5.32,57.4 arc45 6.21,57.78 7.76,59.32 arc45 8.13,60.22 8.13,62.21 arc-45 8.5,63.11 8.77,63.38 arc-45 9.67,63.75 68.07,63.75 arc45 68.33,64.37 68.33,65.01 arc45 67.95,65.9 67.94,65.92 arc45 67.04,66.29 8.65,66.29 arc45 7.76,65.92 6.72,64.89 arc45 6.35,63.99 6.35,63.26 arc-45 5.98,62.37 5.45,61.84 arc-45 4.55,61.47 3.32,61.47 arc45 2.42,61.1 1.39,60.06 arc45 1.02,59.16 1.02,34.56 arc45
  pour Top (no thermals): 7.37,39.12 11.92,39.12 arc-45 12.82,38.74 13.34,38.22 arc-45 13.72,37.32 13.72,35.58 arc-45 13.34,34.68 12.82,34.15 arc-45 11.92,33.78 9.4,33.78 8.89,33.53 6.86,33.53 6.86,38.35 7.37,38.86
XLIMIT
  Top 0.305: 34.04,31.99 U$1.P$26 | 34.04,31.99 C1.1 | JP5.2 67.06,8.87 arc45 66.68,9.77 65.14,11.31 arc45 64.24,11.68 62.76,11.68 arc-45 61.86,12.06 59.3,14.61 arc45 58.4,14.99 55.39,14.99 arc-45 54.49,15.36 53.2,16.65 arc45 52.31,17.02 48.71,17.02 arc-45 48.38,17.15 arc-45 48.01,18.05 48.01,27.67 arc45 47.63,28.57 44.57,31.63 arc45 43.67,32 34.05,32 34.04,31.99
  Top 0.406: JP5.1 JP5.2
YLIMIT  (via drill 0.35)
  Top 0.305: U$1.P$25 C2.1 | JP5.4 61.98,8.87 arc45 61.6,9.77 58.79,12.58 arc45 57.89,12.95 40.15,12.95 arc-45 39.25,13.33 35.93,16.65 arc-45 35.56,17.54 35.56,18.5 arc-45 35.47,18.72 35.47,21.22 arc-45 35.84,22.12 37.22,23.5 arc45 37.59,24.4 v37.59,30.23
  Top 0.406: JP5.3 JP5.4
  Bottom 0.305: v37.59,30.23 34.56,30.23 arc-45 33.66,30.6 31.87,32.39 arc-45 31.5,33.29 U$1.P$25
YMS1
  Top 0.305: 42.67,51.85 MSY.1 | 42.67,51.85 42.67,52.07 | R4.1 30.99,39.88 29.97,40.89 DRIVER_Y.MS1 29.97,44.18 arc-45 30.34,45.08 36.71,51.44 arc-45 37.61,51.82 42.63,51.82 42.67,51.85
YMS2
  Top 0.305: DRIVER_Y.MS2 32.51,44.69 arc-45 32.88,45.58 36.2,48.9 arc-45 37.1,49.28 MSY.3
YMS3
  Top 0.305: DRIVER_Y.MS3 35.05,44.43 arc-45 35.42,45.33 36.46,46.36 arc-45 37.36,46.74 MSY.5
Z_PROBE  (via drill 0.35)
  Top 0.305: C4.1 U$1.P$10 44.2,17.29 arc45 44.57,16.39 44.84,16.12 arc45 45.74,15.75 v51.05,15.75
  Bottom 0.305: JP5.7 54.36,12.17 arc45 53.98,13.07 51.31,15.75 v51.05,15.75
ZLIMIT
  Top 0.305: C3.1 U$1.P$1 24.83,15.56 arc45 25.73,15.19 34.07,15.19 arc-45 34.97,14.81 37.98,11.8 arc45 38.88,11.43 55.1,11.43 arc-45 56,11.06 56.52,10.53 arc-45 56.9,9.63 56.9,8.49 57.01,8.38
  Top 0.406: JP5.5 57.01,8.38 JP5.6
ZMS1
  Top 0.305: R5.1 52.58,39.88 51.93,40.52 arc-45 51.56,41.42 DRIVER_Z.MS1 51.56,45.45 arc-45 51.93,46.35 57.03,51.44 arc-45 57.93,51.82 MSZ.1
ZMS2
  Top 0.305: DRIVER_Z.MS2 54.1,44.69 arc-45 54.47,45.58 57.79,48.9 arc-45 58.69,49.28 MSZ.3
ZMS3
  Top 0.305: DRIVER_Z.MS3 56.64,43.67 arc-45 57.01,44.57 58.81,46.36 arc-45 59.71,46.74 MSZ.5

### Text on the board
tNames: X | Y | Z | A | GND | GND | GND | GND | VM | 1A | 5v | VM | 1B | 1A | 5v | VM | 1A | 5v | VM | 1A | 5v | GM | 2B | 2A | 1B | GM | 2B | 2A | GM | 2B | 2A | 1B | GM | 2B | 2A | 1B | MS1 | MS1 | MS1 | MS1 | MS2 | MS2 | MS2 | MS2 | MS3 | MS3 | MS3 | MS3 | MVCC | POS | 12/ / 24v | Stp A | Dir A | MGND | Z | NEG | Y | X | TX | RX | G | 5v | VU | D- | D+ | G | SP. EN | SP. DIR | SP. PWM | FLOOD | MIST | PROBE | Z+ | Z- | Y+ | Y- | X+ | X- | ABORT | HOLD | C START | DOOR | 5V | S | S | GND | V | G | G
tStop: BluePill CNC Base | Name here